# Altium project 60p_numpad.PrjPcb
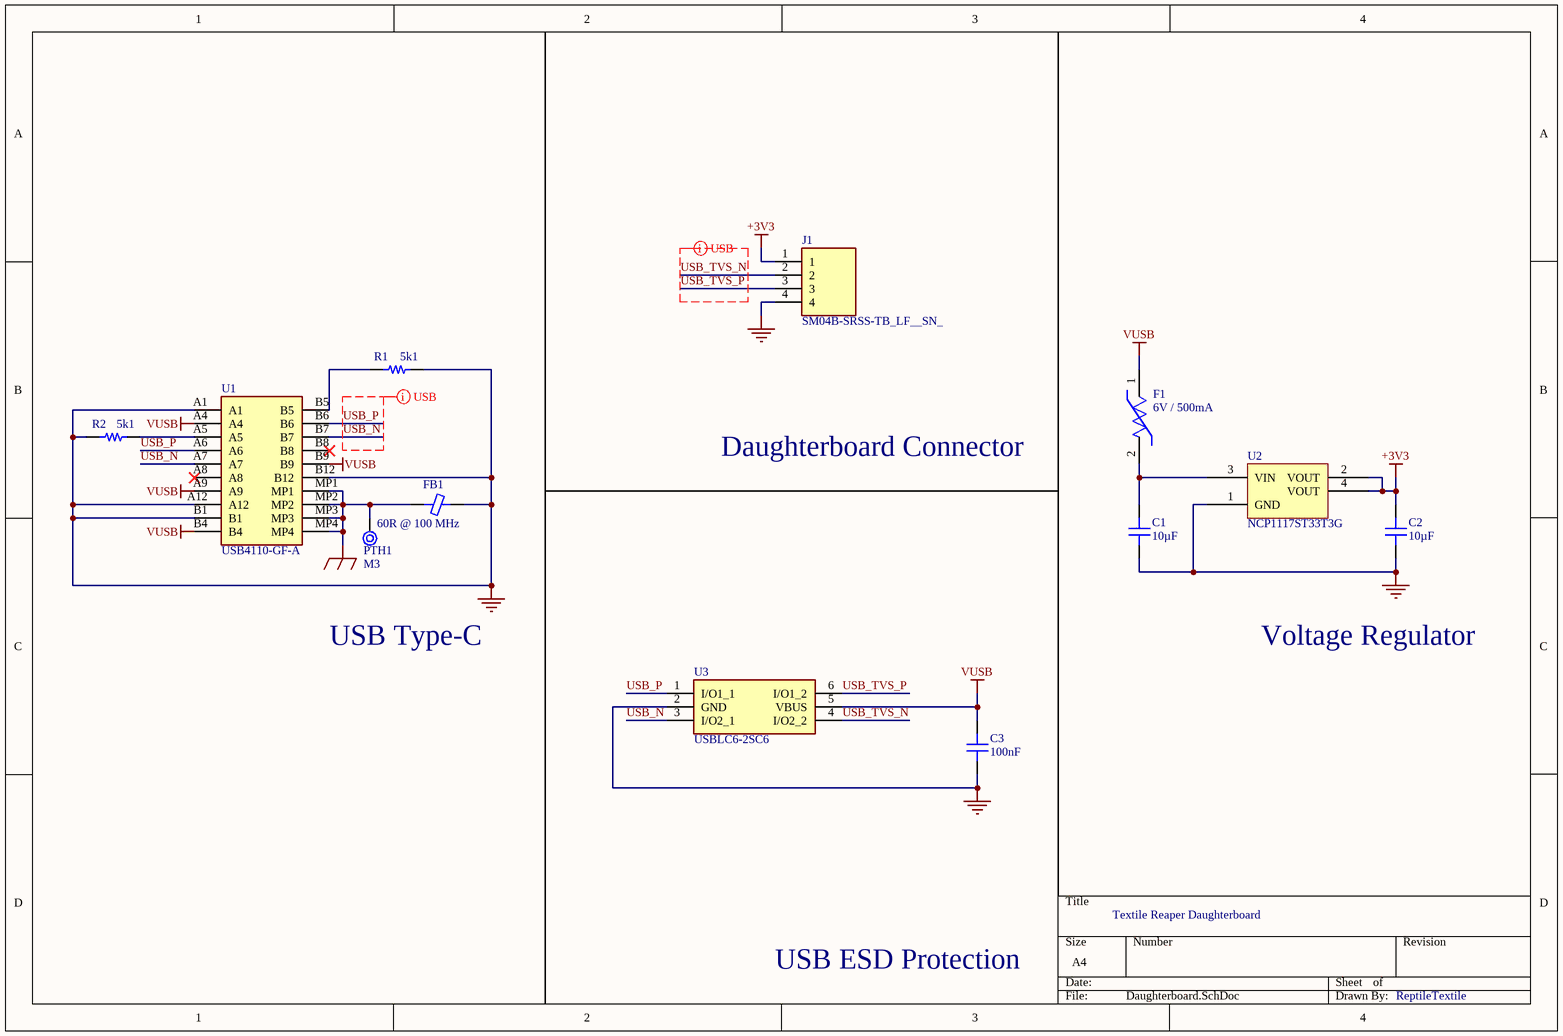
[diagram p0: Daughterboard.SchDoc]
2 sheets, 204 parts. Net scope: global (net labels, ports and power ports of the same name join across sheets).
Board files: DaughterboardPCB.PcbDoc, MainboardPCB.PcbDoc
Sheets:
  Daughterboard.SchDoc
  Mainboard.SchDoc

## Sheet Daughterboard.SchDoc
size A4; SheetNumber: 1; SheetTotal: 1

### Parts
(Parts that share a designator on the sheet are numbered #1, #2 ... from top to bottom, then left to right.)
C1#1  10µF  [CAP 0402_1005]
C2#1  10µF  [CAP 0402_1005]
C3#1  100nF  [CAP 0402_1005]
F1  6V / 500mA  [FP-MF-PSMF-MFG]
FB1  60R @ 100 MHz  [FER 0603_1608]
J1#1  SM04B-SRSS-TB_LF__SN_  [SM04B-SRSS-TB(LFSN)]
PTH1  M3  [SCREW_HOLE]
R1  5k1  [RES 0402_1005]
R2#1  5k1  [RES 0402_1005]
U1#1  USB4110-GF-A  [USB4110GFA]
U2#1  NCP1117ST33T3G  [ON SEMI SOT-223 ST(318H)]
U3  USBLC6-2SC6  [SOT95P280X145-6N]

### Nets
+3V3: C2#1.2 J1#1.1 U2#1.2(VOUT) U2#1.4(VOUT)
CHASIS: FB1.1 PTH1.0 U1#1.MP1 U1#1.MP2 U1#1.MP3 U1#1.MP4
GND: C1#1.1 C2#1.1 C3#1.1 FB1.2 J1#1.4 R1.2 R2#1.1 U1#1.A1 U1#1.A12 U1#1.B1 U1#1.B12 U2#1.1(GND) U3.2(GND)
VUSB: C3#1.2 F1.1 U1#1.A4 U1#1.A9 U1#1.B4 U1#1.B9 U3.5(VBUS)
USB_N: U1#1.A7 U1#1.B7 U3.3(I/O2_1)
USB_P: U1#1.A6 U1#1.B6 U3.1(I/O1_1)
USB_TVS_N: J1#1.2 U3.4(I/O2_2)
USB_TVS_P: J1#1.3 U3.6(I/O1_2)
NetC1#1_2: C1#1.2 F1.2 U2#1.3(VIN)
NetR1_1: R1.1 U1#1.B5
NetR2#1_2: R2#1.2 U1#1.A5

Not connected (* = marked no-connect by the designer): U1#1 A8* B8*

### Layout directives
differential pair; differential pair class USB_Lines; net class USB: USB_N, USB_P
differential pair; net class USB_TVS; differential pair class USB_Lines: USB_TVS_N, USB_TVS_P

### Notes on the sheet
- Daughterboard Connector
- USB Type-C
- Voltage Regulator
- Textile Reaper Daughterboard
- USB ESD Protection
- ReptileTextile

### Library data of the parts
C1#1 C2#1 = CL05A106MP8NUB8: CAP CER 10UF 10V X5R 0402; manufacturer: Samsung Electro-Mechanics; Tolerance: ±20%; Part Number: CL05A106MP8NUB8; Value: 10µF; Applications: General Purpose; Capacitance: 10 µF; componentlink1description: Datasheet; componentlink1url: http://www.samsungsem.com/kr/support/product-search/mlcc/CL05A106MP8NUB8.jsp; componentlink2description: DigiKey Link; componentlink2url: https://www.digikey.com/en/products/detail/samsung-electro-mechanics/CL05A106MP8NUB8/5961314; Device Package: 0402 (1005 Metric); lastupdated: 11.08.2022 08:52:23; Lifecycle Status: Active; Minimum Order: 1; Mounting Type: Surface Mount, MLCC; Operating Temperature: -55°C ~ 85°C; Package / Case: 0402 (1005 Metric); packaging: TapeAndReel; partid: 1758; Part Status: Active; price: 0.07; series: CL; Size / Dimension: 0.039" L x 0.020" W (1.00mm x 0.50mm); Supplier 1: DigiKey; Supplier Part Number 1: 1276-6830-1-ND; Temperature Coefficient: X5R; Thickness (Max): 0.035" (0.90mm); Voltage - Rated: 10V
C3#1 = C0402C104K4RECAUTO: CAP CER 0402 0.1UF 16V X7R 10%; manufacturer: KEMET; Capacitance: 0.1 µF; Part Number: C0402C104K4RECAUTO; Value: 100nF; Applications: Automotive, ESD Protection; componentlink1description: Datasheet; componentlink1url: https://api.kemet.com/component-edge/download/datasheet/C0402C104K4RECAUTO.pdf; componentlink2description: DigiKey Link; componentlink2url: https://www.digikey.com/en/products/detail/kemet/C0402C104K4RECAUTO/8563695; Device Package: 0402 (1005 Metric); lastupdated: 11.08.2022 08:52:24; Lifecycle Status: Active; Minimum Order: 1; Mounting Type: Surface Mount, MLCC; Operating Temperature: -55°C ~ 125°C; Package / Case: 0402 (1005 Metric); packaging: TapeAndReel; partid: 1731; Part Status: Active; price: 0.02; Ratings: AEC-Q200; series: ESD SMD Auto X7R; Size / Dimension: 0.039" L x 0.020" W (1.00mm x 0.50mm); Supplier 1: DigiKey; Supplier Part Number 1: 399-17167-1-ND; Temperature Coefficient: X7R; Thickness (Max): 0.022" (0.55mm); Tolerance: ±10%; Voltage - Rated: 16V
F1 = CMP-07400-000013-1: PTC RESET FUSE 6V 500MA 0805; Manufacturer Part Number: MF-PSMF050X-2; Manufacturer: Bourns Inc.; Trip Current: 1A; Trip Time: 0.1s; Value: 0.15-0.9Ω; Hold Current: 0.5A; Current Rating: 40A; Category: Fuse; Temperature: -40°C to +85°C; ComponentLink2Description: Datasheet; Temperature Range High: +85°C; Package: MF-PSMF; Device Class L1: Circuit Protection; Lead Free: Yes; ComponentLink2URL: https://www.bourns.com/docs/product-datasheets/mfpsmf.pdf?sfvrsn=9c05cafe_24; Ambient Temperature Range Low: -40°C; Mouser Description: Resettable Fuses - PPTC .50A 6V 0.15ohm Hold .5 Trip 1; Resistance: 0.15-0.9Ω; Automotive: Yes; Ambient Temperature Range High: +85°C; Device Class L2: PTC Resettable Fuses; Temperature Range Low: -40°C; Device Class L3: unset; Octopart: https://octopart.com/mf-psmf050x-2-bourns-7483438; Digikey Description: PTC RESET FUSE 6V 500MA 0805; Height: 0.85mm; RoHS: TRUE; Voltage Rating: 6V
FB1 = FBTH1608HE600-T: FERRITE BEAD,HIGH CURRENT, 0603; Manufacturer: Taiyo Yuden; Current Rating (Max): 2.25A; DC Resistance (DCR) (Max): 25mOhm; Filter Type: Power Line; Impedance @ Frequency: 60 Ohms @ 100 MHz; Number of Lines: 1; Part Number: FBTH1608HE600-T; ComponentLink1Description: Datasheet; ComponentLink1URL: https://ds.yuden.co.jp/TYCOMPAS/ut/detail?pn=FBTH1608HE600-T&u=M; ComponentLink2Description: DigiKey Link; ComponentLink2URL: https://www.digikey.com/en/products/detail/taiyo-yuden/FBTH1608HE600-T/10324933; Device Package: 0603 (1608 Metric); Height (Max): 0.037" (0.95mm); LastUpdated: 11.08.2022 09:33:59; Lifecycle Status: Active; Minimum Order: 1; Mounting Type: Surface Mount; Operating Temperature: -40°C ~ 150°C; Package / Case: 0603 (1608 Metric); Packaging: TapeAndReel; PartId: 706; Part Status: Active; Price: 0.09; Ratings: AEC-Q200; Series: FB; Size / Dimension: 0.063" L x 0.031" W (1.60mm x 0.80mm); Supplier 1: DigiKey; Supplier Part Number 1: 587-6594-1-ND; Value: 60R @ 100 MHz
J1#1 = SM04B-SRSS-TB_LF__SN_: Connector; Manufacturer_Name: JST (JAPAN SOLDERLESS TERMINALS); Manufacturer_Part_Number: SM04B-SRSS-TB(LF)(SN); Datasheet Link: http://www.jst-mfg.com/product/pdf/eng/eSH.pdf; Arrow Part Number: SM04B-SRSS-TB(LF)(SN); Arrow Price/Stock: https://www.arrow.com/en/products/sm04b-srss-tb-lf-sn/jst-manufacturing
PTH1 = Hole
R1 R2#1 = RC0402JR-075K1L: RES 5.1K OHM 5% 1/16W 0402; Manufacturer: Yageo; Power (Watts): 0.063W, 1/16W; Resistance: 5.1 kOhms; Temperature Coefficient: ±100ppm/°C; Part Number: RC0402JR-075K1L; Value: 5k1; ComponentLink1Description: Datasheet; ComponentLink1URL: https://www.yageo.com/upload/media/product/productsearch/datasheet/rchip/PYu-RC_Group_51_RoHS_L_10.pdf; ComponentLink2Description: DigiKey Link; ComponentLink2URL: https://www.digikey.com/en/products/detail/yageo/RC0402JR-075K1L/726487; Composition: Thick Film; Device Package: 0402 (1005 Metric); Features: Moisture Resistant; Height - Seated (Max): 0.016" (0.40mm); LastUpdated: 11.08.2022 09:08:05; Lifecycle Status: Active; Minimum Order: 1; Number of Terminations: 2; Operating Temperature: -55°C ~ 155°C; Package / Case: 0402 (1005 Metric); Packaging: CutTape; PartId: 4786; Part Status: Active; Price: 0.01; Series: RC_L; Size / Dimension: 0.039" L x 0.020" W (1.00mm x 0.50mm); Supplier 1: DigiKey; Supplier Part Number 1: 311-5.1KJRCT-ND; Supplier Device Package: 0402; Tolerance: ±5%
U1#1 = USB4110-GF-A: Connector; Manufacturer_Name: GCT (GLOBAL CONNECTOR TECHNOLOGY); Datasheet Link: https://gct.co/files/drawings/usb4110.pdf; Height: 3.26mm; Manufacturer_Part_Number: USB4110-GF-A; Mouser Part Number: 640-USB4110-GF-A; Mouser Price/Stock: https://www.mouser.co.uk/ProductDetail/GCT/USB4110-GF-A?qs=KUoIvG%2F9IlYiZvIXQjyJeA%3D%3D
U2#1 = NCP1117ST33T3G: IC REG LINEAR 3.3V 1A SOT223; Manufacturer: ON Semiconductor; Current - Quiescent (Iq): 10mA; Number of Regulators: 1; Output Configuration: Positive; Output Type: Fixed; Protection Features: Over Current, Over Temperature; PSRR: 64dB (120Hz); Voltage Dropout (Max): 1.2V @ 800mA; Voltage - Input (Max): 20V; Part Number: NCP1117ST33T3G; ComponentLink1Description: Datasheet; ComponentLink1URL: https://www.onsemi.com/pub/Collateral/NCP1117-D.PDF; ComponentLink2Description: DigiKey Link; ComponentLink2URL: http://digikey.com/product-detail/en/on-semiconductor/NCP1117ST33T3G/NCP1117ST33T3GOSCT-ND/660708; Current - Output: 1A; LastUpdated: 9.08.2022 12:47:35; Lifecycle Status: Active; Minimum Order: 1; Mounting Type: Surface Mount; Package / Case: TO-261-4, TO-261AA; Packaging: TapeAndReel; Part Status: Active; Price: 0.15; Series: -; Supplier 1: DigiKey; Supplier Part Number 1: NCP1117ST33T3GOSCT-ND; Supplier Device Package: SOT-223; Voltage - Output (Min/Fixed): 3.3V
U3 = USBLC6-2SC6: Integrated Circuit; Manufacturer_Name: STMicroelectronics; Datasheet Link: http://www.st.com/st-web-ui/static/active/en/resource/technical/document/datasheet/CD00050750.pdf; Height: 1.45mm; Manufacturer_Part_Number: USBLC6-2SC6; Mouser Part Number: 511-USBLC6-2SC6; Mouser Price/Stock: https://www.mouser.co.uk/ProductDetail/STMicroelectronics/USBLC6-2SC6?qs=po45yt2pPpu%2FhNIlwQdTlg%3D%3D; Arrow Part Number: USBLC6-2SC6; Arrow Price/Stock: https://www.arrow.com/en/products/usblc6-2sc6/stmicroelectronics?region=nac

## Sheet Mainboard.SchDoc
size A2; SheetNumber: 1; SheetTotal: 1
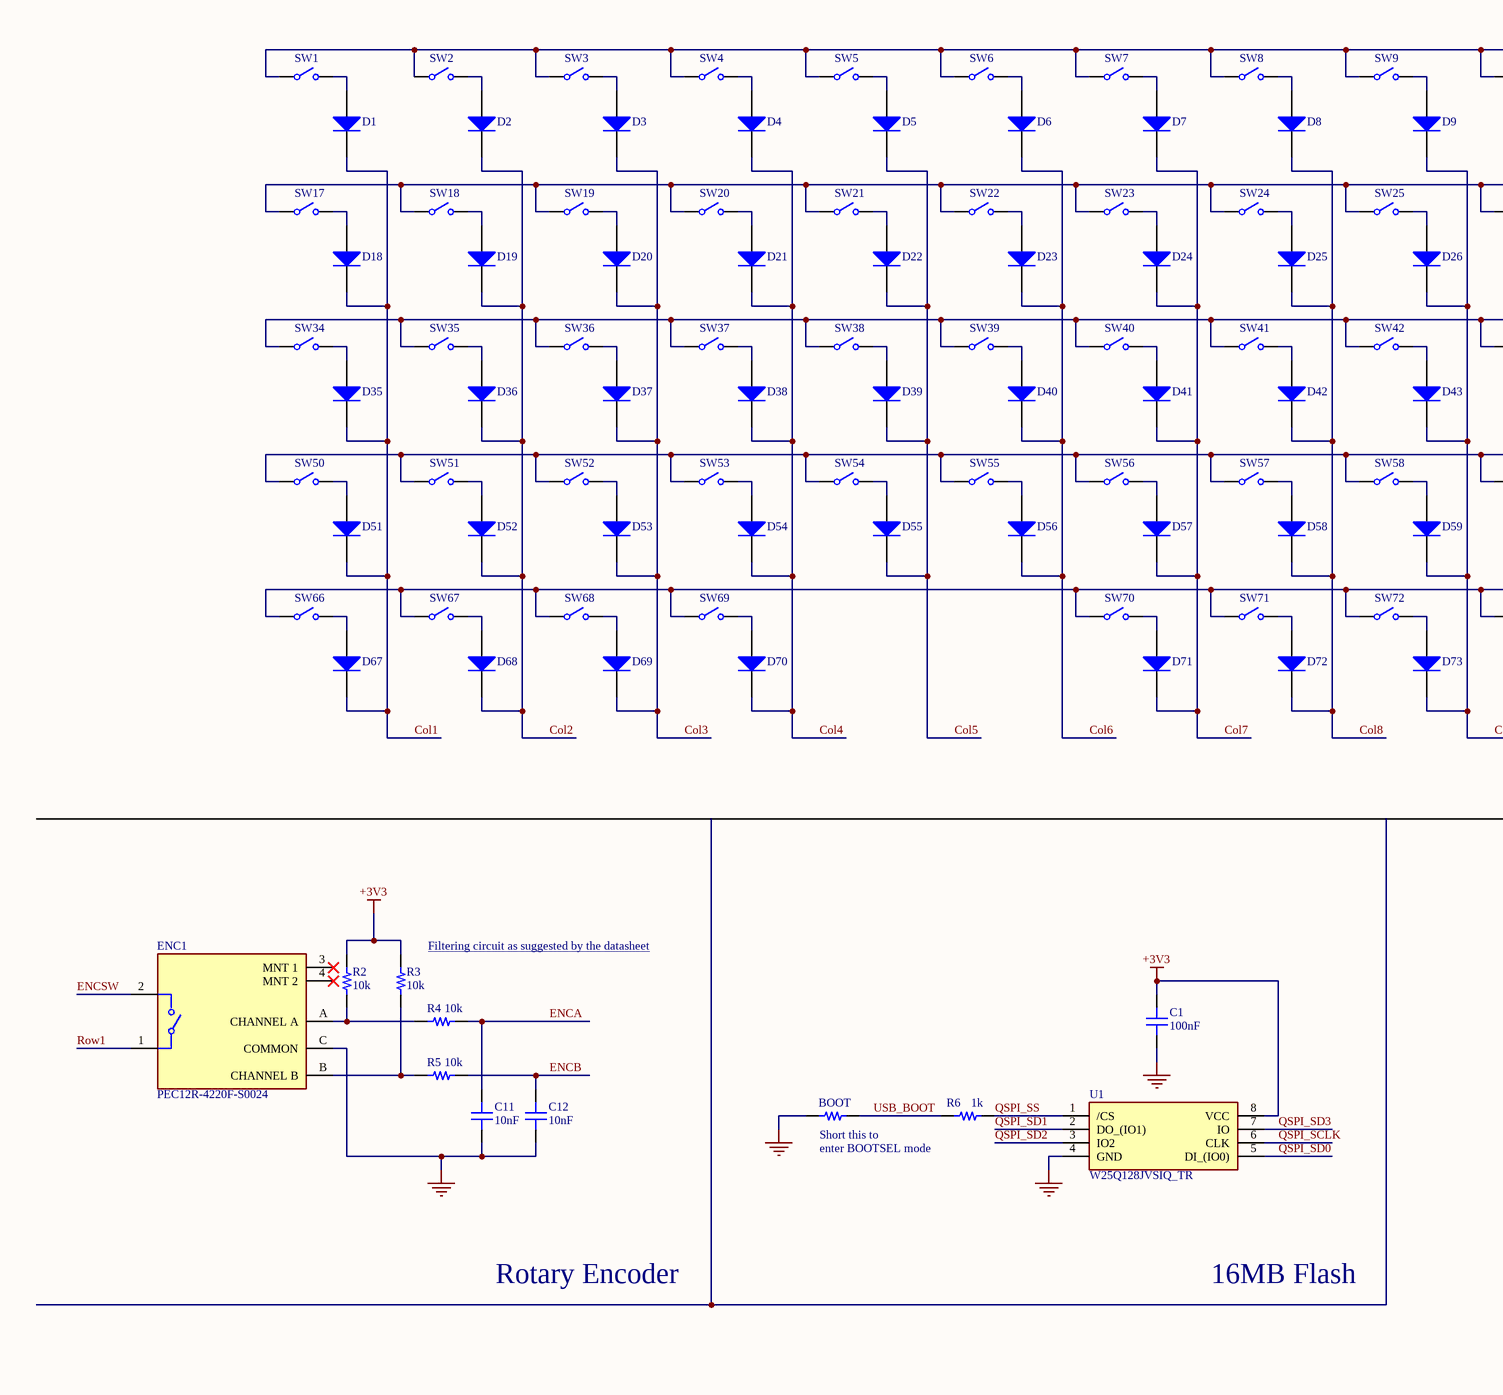
[diagram p1: Mainboard.SchDoc, left]
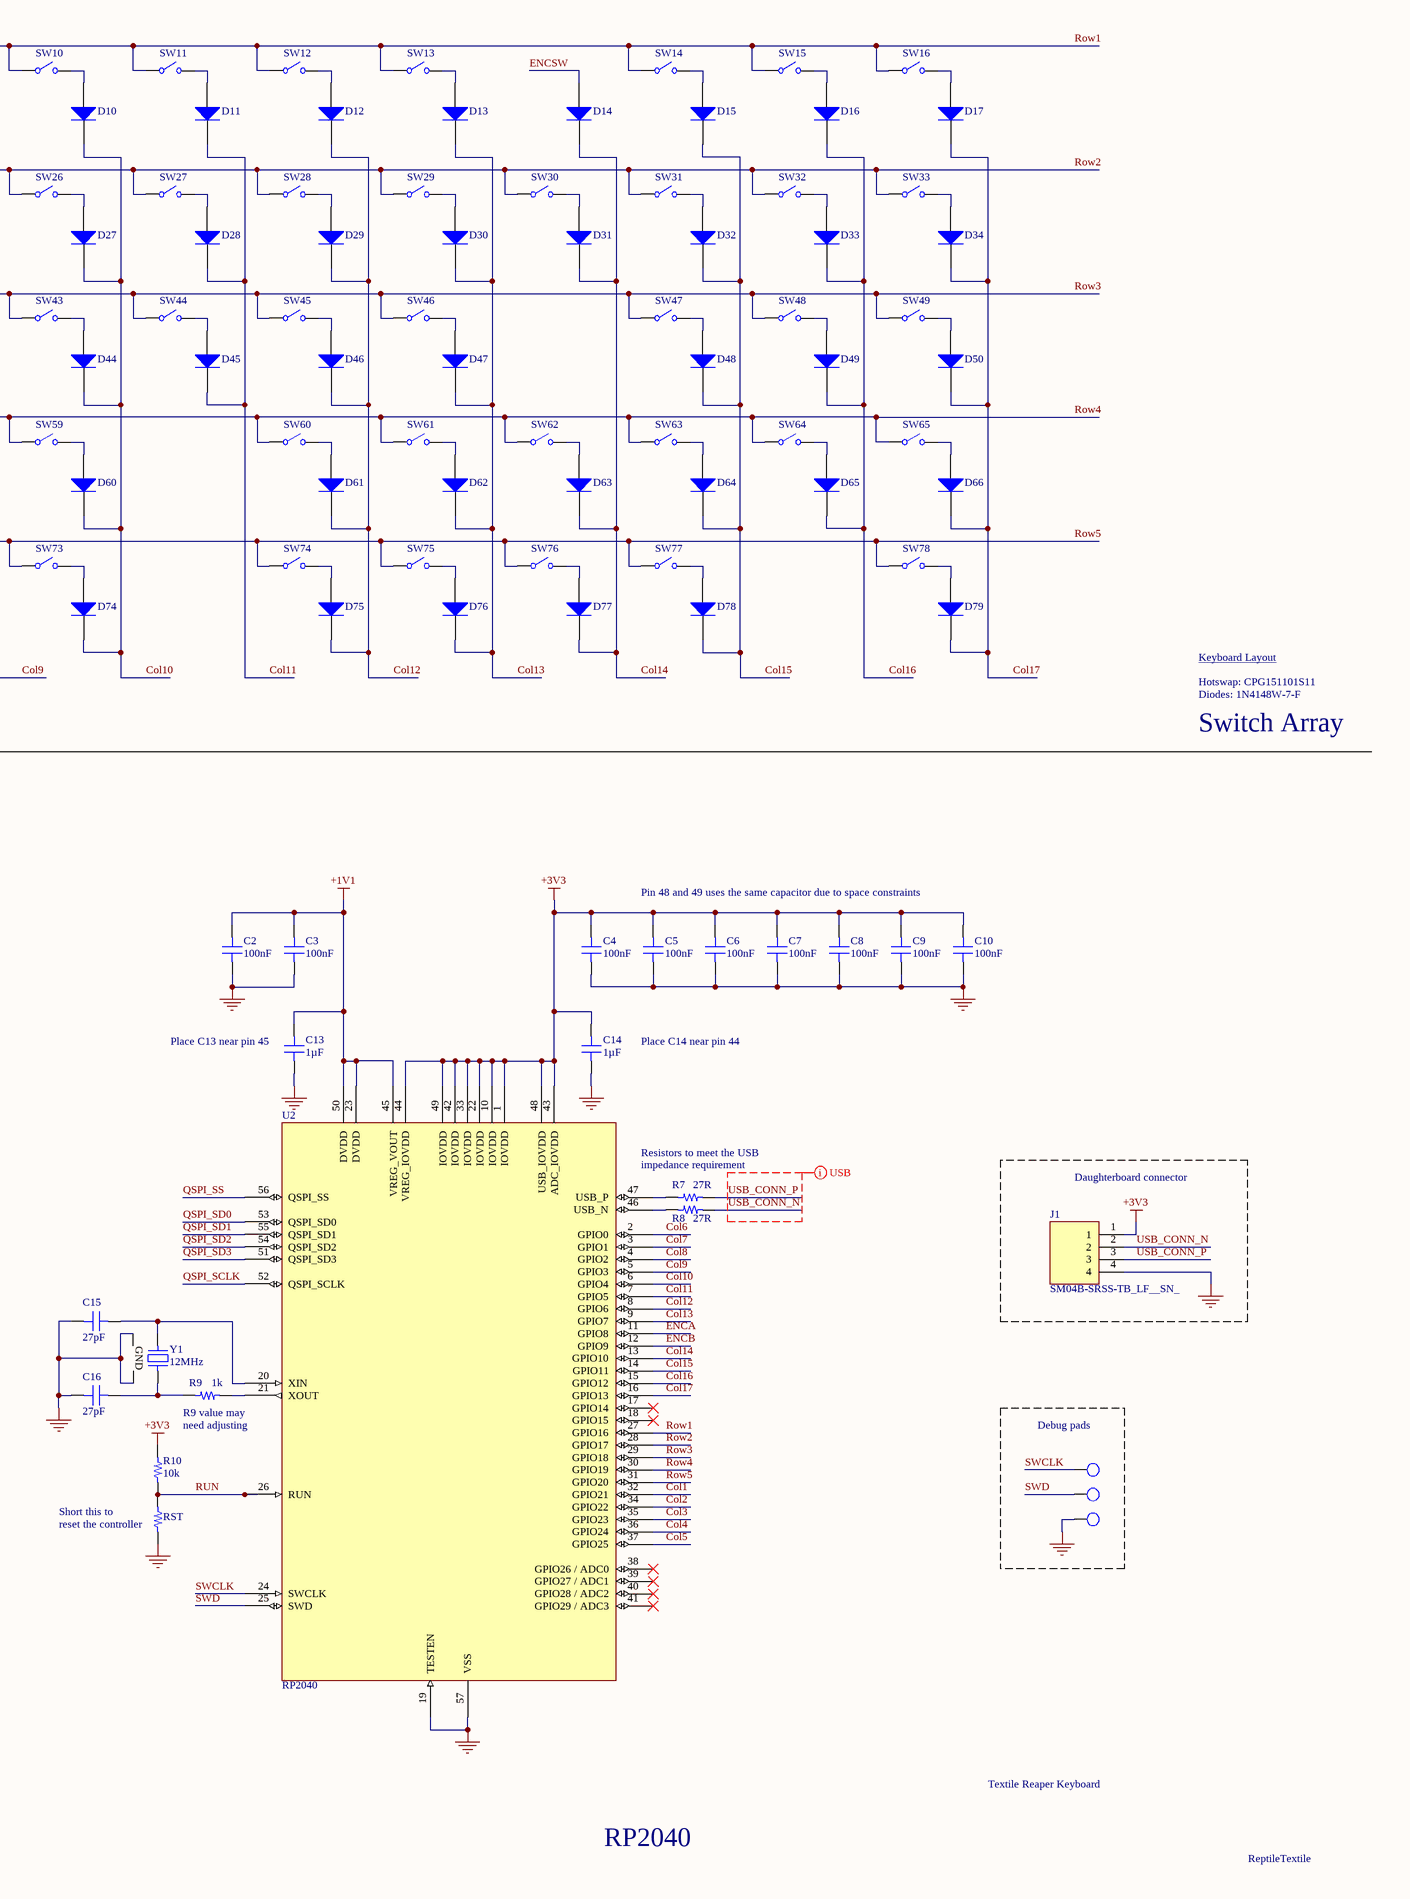
[diagram p2: Mainboard.SchDoc, right]

### Parts
(Parts that share a designator on the sheet are numbered #1, #2 ... from top to bottom, then left to right.)
BOOT  0  [RES 0402_1005]  (value not drawn)
C1#2  100nF  [CAP 0402_1005]
C2#2  100nF  [CAP 0402_1005]
C3#2  100nF  [CAP 0402_1005]
C4  100nF  [CAP 0402_1005]
C5  100nF  [CAP 0402_1005]
C6  100nF  [CAP 0402_1005]
C7  100nF  [CAP 0402_1005]
C8  100nF  [CAP 0402_1005]
C9  100nF  [CAP 0402_1005]
C10  100nF  [CAP 0402_1005]
C11  10nF  [CAP 0402_1005]
C12  10nF  [CAP 0402_1005]
C13  1µF  [CAP 0402_1005]
C14  1µF  [CAP 0402_1005]
C15  27pF  [CAP 0402_1005]
C16  27pF  [CAP 0402_1005]
D1  1N4148W-7-F  [DIOD-SOD123-2_V]  (value not drawn)
D2  1N4148W-7-F  [DIOD-SOD123-2_V]  (value not drawn)
D3  1N4148W-7-F  [DIOD-SOD123-2_V]  (value not drawn)
D4  1N4148W-7-F  [DIOD-SOD123-2_V]  (value not drawn)
D5  1N4148W-7-F  [DIOD-SOD123-2_V]  (value not drawn)
D6  1N4148W-7-F  [DIOD-SOD123-2_V]  (value not drawn)
D7  1N4148W-7-F  [DIOD-SOD123-2_V]  (value not drawn)
D8  1N4148W-7-F  [DIOD-SOD123-2_V]  (value not drawn)
D9  1N4148W-7-F  [DIOD-SOD123-2_V]  (value not drawn)
D10  1N4148W-7-F  [DIOD-SOD123-2_V]  (value not drawn)
D11  1N4148W-7-F  [DIOD-SOD123-2_V]  (value not drawn)
D12  1N4148W-7-F  [DIOD-SOD123-2_V]  (value not drawn)
D13  1N4148W-7-F  [DIOD-SOD123-2_V]  (value not drawn)
D14  1N4148W-7-F  [DIOD-SOD123-2_V]  (value not drawn)
D15  1N4148W-7-F  [DIOD-SOD123-2_V]  (value not drawn)
D16  1N4148W-7-F  [DIOD-SOD123-2_V]  (value not drawn)
D17  1N4148W-7-F  [DIOD-SOD123-2_V]  (value not drawn)
D18  1N4148W-7-F  [DIOD-SOD123-2_V]  (value not drawn)
D19  1N4148W-7-F  [DIOD-SOD123-2_V]  (value not drawn)
D20  1N4148W-7-F  [DIOD-SOD123-2_V]  (value not drawn)
D21  1N4148W-7-F  [DIOD-SOD123-2_V]  (value not drawn)
D22  1N4148W-7-F  [DIOD-SOD123-2_V]  (value not drawn)
D23  1N4148W-7-F  [DIOD-SOD123-2_V]  (value not drawn)
D24  1N4148W-7-F  [DIOD-SOD123-2_V]  (value not drawn)
D25  1N4148W-7-F  [DIOD-SOD123-2_V]  (value not drawn)
D26  1N4148W-7-F  [DIOD-SOD123-2_V]  (value not drawn)
D27  1N4148W-7-F  [DIOD-SOD123-2_V]  (value not drawn)
D28  1N4148W-7-F  [DIOD-SOD123-2_V]  (value not drawn)
D29  1N4148W-7-F  [DIOD-SOD123-2_V]  (value not drawn)
D30  1N4148W-7-F  [DIOD-SOD123-2_V]  (value not drawn)
D31  1N4148W-7-F  [DIOD-SOD123-2_V]  (value not drawn)
D32  1N4148W-7-F  [DIOD-SOD123-2_V]  (value not drawn)
D33  1N4148W-7-F  [DIOD-SOD123-2_V]  (value not drawn)
D34  1N4148W-7-F  [DIOD-SOD123-2_V]  (value not drawn)
D35  1N4148W-7-F  [DIOD-SOD123-2_V]  (value not drawn)
D36  1N4148W-7-F  [DIOD-SOD123-2_V]  (value not drawn)
D37  1N4148W-7-F  [DIOD-SOD123-2_V]  (value not drawn)
D38  1N4148W-7-F  [DIOD-SOD123-2_V]  (value not drawn)
D39  1N4148W-7-F  [DIOD-SOD123-2_V]  (value not drawn)
D40  1N4148W-7-F  [DIOD-SOD123-2_V]  (value not drawn)
D41  1N4148W-7-F  [DIOD-SOD123-2_V]  (value not drawn)
D42  1N4148W-7-F  [DIOD-SOD123-2_V]  (value not drawn)
D43  1N4148W-7-F  [DIOD-SOD123-2_V]  (value not drawn)
D44  1N4148W-7-F  [DIOD-SOD123-2_V]  (value not drawn)
D45  1N4148W-7-F  [DIOD-SOD123-2_V]  (value not drawn)
D46  1N4148W-7-F  [DIOD-SOD123-2_V]  (value not drawn)
D47  1N4148W-7-F  [DIOD-SOD123-2_V]  (value not drawn)
D48  1N4148W-7-F  [DIOD-SOD123-2_V]  (value not drawn)
D49  1N4148W-7-F  [DIOD-SOD123-2_V]  (value not drawn)
D50  1N4148W-7-F  [DIOD-SOD123-2_V]  (value not drawn)
D51  1N4148W-7-F  [DIOD-SOD123-2_V]  (value not drawn)
D52  1N4148W-7-F  [DIOD-SOD123-2_V]  (value not drawn)
D53  1N4148W-7-F  [DIOD-SOD123-2_V]  (value not drawn)
D54  1N4148W-7-F  [DIOD-SOD123-2_V]  (value not drawn)
D55  1N4148W-7-F  [DIOD-SOD123-2_V]  (value not drawn)
D56  1N4148W-7-F  [DIOD-SOD123-2_V]  (value not drawn)
D57  1N4148W-7-F  [DIOD-SOD123-2_V]  (value not drawn)
D58  1N4148W-7-F  [DIOD-SOD123-2_V]  (value not drawn)
D59  1N4148W-7-F  [DIOD-SOD123-2_V]  (value not drawn)
D60  1N4148W-7-F  [DIOD-SOD123-2_V]  (value not drawn)
D61  1N4148W-7-F  [DIOD-SOD123-2_V]  (value not drawn)
D62  1N4148W-7-F  [DIOD-SOD123-2_V]  (value not drawn)
D63  1N4148W-7-F  [DIOD-SOD123-2_V]  (value not drawn)
D64  1N4148W-7-F  [DIOD-SOD123-2_V]  (value not drawn)
D65  1N4148W-7-F  [DIOD-SOD123-2_V]  (value not drawn)
D66  1N4148W-7-F  [DIOD-SOD123-2_V]  (value not drawn)
D67  1N4148W-7-F  [DIOD-SOD123-2_V]  (value not drawn)
D68  1N4148W-7-F  [DIOD-SOD123-2_V]  (value not drawn)
D69  1N4148W-7-F  [DIOD-SOD123-2_V]  (value not drawn)
D70  1N4148W-7-F  [DIOD-SOD123-2_V]  (value not drawn)
D71  1N4148W-7-F  [DIOD-SOD123-2_V]  (value not drawn)
D72  1N4148W-7-F  [DIOD-SOD123-2_V]  (value not drawn)
D73  1N4148W-7-F  [DIOD-SOD123-2_V]  (value not drawn)
D74  1N4148W-7-F  [DIOD-SOD123-2_V]  (value not drawn)
D75  1N4148W-7-F  [DIOD-SOD123-2_V]  (value not drawn)
D76  1N4148W-7-F  [DIOD-SOD123-2_V]  (value not drawn)
D77  1N4148W-7-F  [DIOD-SOD123-2_V]  (value not drawn)
D78  1N4148W-7-F  [DIOD-SOD123-2_V]  (value not drawn)
D79  1N4148W-7-F  [DIOD-SOD123-2_V]  (value not drawn)
ENC1  PEC12R-4220F-S0024  [FP-PEC12R-4220F-S0024-MFG]
GND  Pad  [Square_Pad]  (value not drawn)
J1#2  SM04B-SRSS-TB_LF__SN_  [SM04B-SRSS-TB(LFSN)]
R2#2  10k  [RES 0402_1005]
R3  10k  [RES 0402_1005]
R4  10k  [RES 0402_1005]
R5  10k  [RES 0402_1005]
R6  1k  [RES 0402_1005]
R7  27R  [RES 0402_1005]
R8  27R  [RES 0402_1005]
R9  1k  [RES 0402_1005]
R10  10k  [RES 0402_1005]
RST  0  [RES 0402_1005]  (value not drawn)
SW1  CPG151101S11  [CPG151101S11]  (value not drawn)
SW2  CPG151101S11  [CPG151101S11]  (value not drawn)
SW3  CPG151101S11  [CPG151101S11]  (value not drawn)
SW4  CPG151101S11  [CPG151101S11]  (value not drawn)
SW5  CPG151101S11  [CPG151101S11]  (value not drawn)
SW6  CPG151101S11  [CPG151101S11]  (value not drawn)
SW7  CPG151101S11  [CPG151101S11]  (value not drawn)
SW8  CPG151101S11  [CPG151101S11]  (value not drawn)
SW9  CPG151101S11  [CPG151101S11]  (value not drawn)
SW10  CPG151101S11  [CPG151101S11]  (value not drawn)
SW11  CPG151101S11  [CPG151101S11]  (value not drawn)
SW12  CPG151101S11  [CPG151101S11]  (value not drawn)
SW13  CPG151101S11  [CPG151101S11]  (value not drawn)
SW14  CPG151101S11  [CPG151101S11]  (value not drawn)
SW15  CPG151101S11  [CPG151101S11]  (value not drawn)
SW16  CPG151101S11  [CPG151101S11]  (value not drawn)
SW17  CPG151101S11  [CPG151101S11]  (value not drawn)
SW18  CPG151101S11  [CPG151101S11]  (value not drawn)
SW19  CPG151101S11  [CPG151101S11]  (value not drawn)
SW20  CPG151101S11  [CPG151101S11]  (value not drawn)
SW21  CPG151101S11  [CPG151101S11]  (value not drawn)
SW22  CPG151101S11  [CPG151101S11]  (value not drawn)
SW23  CPG151101S11  [CPG151101S11]  (value not drawn)
SW24  CPG151101S11  [CPG151101S11]  (value not drawn)
SW25  CPG151101S11  [CPG151101S11]  (value not drawn)
SW26  CPG151101S11  [CPG151101S11]  (value not drawn)
SW27  CPG151101S11  [CPG151101S11]  (value not drawn)
SW28  CPG151101S11  [CPG151101S11]  (value not drawn)
SW29  CPG151101S11  [CPG151101S11]  (value not drawn)
SW30  CPG151101S11  [CPG151101S11]  (value not drawn)
SW31  CPG151101S11  [CPG151101S11]  (value not drawn)
SW32  CPG151101S11  [CPG151101S11]  (value not drawn)
SW33  CPG151101S11  [CPG151101S11]  (value not drawn)
SW34  CPG151101S11  [CPG151101S11]  (value not drawn)
SW35  CPG151101S11  [CPG151101S11]  (value not drawn)
SW36  CPG151101S11  [CPG151101S11]  (value not drawn)
SW37  CPG151101S11  [CPG151101S11]  (value not drawn)
SW38  CPG151101S11  [CPG151101S11]  (value not drawn)
SW39  CPG151101S11  [CPG151101S11]  (value not drawn)
SW40  CPG151101S11  [CPG151101S11]  (value not drawn)
SW41  CPG151101S11  [CPG151101S11]  (value not drawn)
SW42  CPG151101S11  [CPG151101S11]  (value not drawn)
SW43  CPG151101S11  [CPG151101S11]  (value not drawn)
SW44  CPG151101S11  [CPG151101S11]  (value not drawn)
SW45  CPG151101S11  [CPG151101S11]  (value not drawn)
SW46  CPG151101S11  [CPG151101S11]  (value not drawn)
SW47  CPG151101S11  [CPG151101S11]  (value not drawn)
SW48  CPG151101S11  [CPG151101S11]  (value not drawn)
SW49  CPG151101S11  [CPG151101S11]  (value not drawn)
SW50  CPG151101S11  [CPG151101S11]  (value not drawn)
SW51  CPG151101S11  [CPG151101S11]  (value not drawn)
SW52  CPG151101S11  [CPG151101S11]  (value not drawn)
SW53  CPG151101S11  [CPG151101S11]  (value not drawn)
SW54  CPG151101S11  [CPG151101S11]  (value not drawn)
SW55  CPG151101S11  [CPG151101S11]  (value not drawn)
SW56  CPG151101S11  [CPG151101S11]  (value not drawn)
SW57  CPG151101S11  [CPG151101S11]  (value not drawn)
SW58  CPG151101S11  [CPG151101S11]  (value not drawn)
SW59  CPG151101S11  [CPG151101S11]  (value not drawn)
SW60  CPG151101S11  [CPG151101S11]  (value not drawn)
SW61  CPG151101S11  [CPG151101S11]  (value not drawn)
SW62  CPG151101S11  [CPG151101S11]  (value not drawn)
SW63  CPG151101S11  [CPG151101S11]  (value not drawn)
SW64  CPG151101S11  [CPG151101S11]  (value not drawn)
SW65  CPG151101S11  [CPG151101S11]  (value not drawn)
SW66  CPG151101S11  [CPG151101S11]  (value not drawn)
SW67  CPG151101S11  [CPG151101S11]  (value not drawn)
SW68  CPG151101S11  [CPG151101S11]  (value not drawn)
SW69  CPG151101S11  [CPG151101S11]  (value not drawn)
SW70  CPG151101S11  [CPG151101S11]  (value not drawn)
SW71  CPG151101S11  [CPG151101S11]  (value not drawn)
SW72  CPG151101S11  [CPG151101S11]  (value not drawn)
SW73  CPG151101S11  [CPG151101S11]  (value not drawn)
SW74  CPG151101S11  [CPG151101S11]  (value not drawn)
SW75  CPG151101S11  [CPG151101S11]  (value not drawn)
SW76  CPG151101S11  [CPG151101S11]  (value not drawn)
SW77  CPG151101S11  [CPG151101S11]  (value not drawn)
SW78  CPG151101S11  [CPG151101S11]  (value not drawn)
SWCLK  Pad  [Square_Pad]  (value not drawn)
SWD  Pad  [Square_Pad]  (value not drawn)
U1#2  W25Q128JVSIQ_TR  [SOIC127P780X195-8N]
U2#2  RP2040  [RP2040_QFN56]
Y1  12MHz  [ABRACON ABM8G]

### Blocks framed on the sheet
Daughterboard connector: J1#2
Debug pads: GND SWCLK SWD

### Nets
+1V1: C2#2.2 C3#2.2 C13.2 U2#2.23(DVDD) U2#2.45(VREG_VOUT) U2#2.50(DVDD)
+3V3: C1#2.2 C4.2 C5.2 C6.2 C7.2 C8.2 C9.2 C10.2 C14.2 J1#2.1 R2#2.1 R3.1 R10.1 U1#2.8(VCC) U2#2.1(IOVDD) U2#2.10(IOVDD) U2#2.22(IOVDD) U2#2.33(IOVDD) U2#2.42(IOVDD) U2#2.43(ADC_IOVDD) U2#2.44(VREG_IOVDD) U2#2.48(USB_IOVDD) U2#2.49(IOVDD)
GND: BOOT.1 C1#2.1 C2#2.1 C3#2.1 C4.1 C5.1 C6.1 C7.1 C8.1 C9.1 C10.1 C11.1 C12.1 C13.1 C14.1 C15.1 C16.1 ENC1.C(COMMON) GND.0 J1#2.4 RST.1 U1#2.4(GND) U2#2.19(TESTEN) U2#2.57(VSS) Y1.2(GND) Y1.4(GND)
Col1: D1.2(K) D18.2(K) D35.2(K) D51.2(K) D67.2(K) U2#2.32(GPIO21)
Col2: D2.2(K) D19.2(K) D36.2(K) D52.2(K) D68.2(K) U2#2.34(GPIO22)
Col3: D3.2(K) D20.2(K) D37.2(K) D53.2(K) D69.2(K) U2#2.35(GPIO23)
Col4: D4.2(K) D21.2(K) D38.2(K) D54.2(K) D70.2(K) U2#2.36(GPIO24)
Col5: D5.2(K) D22.2(K) D39.2(K) D55.2(K) U2#2.37(GPIO25)
Col6: D6.2(K) D23.2(K) D40.2(K) D56.2(K) U2#2.2(GPIO0)
Col7: D7.2(K) D24.2(K) D41.2(K) D57.2(K) D71.2(K) U2#2.3(GPIO1)
Col8: D8.2(K) D25.2(K) D42.2(K) D58.2(K) D72.2(K) U2#2.4(GPIO2)
Col9: D9.2(K) D26.2(K) D43.2(K) D59.2(K) D73.2(K) U2#2.5(GPIO3)
Col10: D10.2(K) D27.2(K) D44.2(K) D60.2(K) D74.2(K) U2#2.6(GPIO4)
Col11: D11.2(K) D28.2(K) D45.2(K) U2#2.7(GPIO5)
Col12: D12.2(K) D29.2(K) D46.2(K) D61.2(K) D75.2(K) U2#2.8(GPIO6)
Col13: D13.2(K) D30.2(K) D47.2(K) D62.2(K) D76.2(K) U2#2.9(GPIO7)
Col14: D14.2(K) D31.2(K) D63.2(K) D77.2(K) U2#2.13(GPIO10)
Col15: D15.2(K) D32.2(K) D48.2(K) D64.2(K) D78.2(K) U2#2.14(GPIO11)
Col16: D16.2(K) D33.2(K) D49.2(K) D65.2(K) U2#2.15(GPIO12)
Col17: D17.2(K) D34.2(K) D50.2(K) D66.2(K) D79.2(K) U2#2.16(GPIO13)
ENCA: C11.2 R4.2 U2#2.11(GPIO8)
ENCB: C12.2 R5.2 U2#2.12(GPIO9)
ENCSW: D14.1(A) ENC1.2
QSPI_SCLK: U1#2.6(CLK) U2#2.52(QSPI_SCLK)
QSPI_SD0: U1#2.5(DI_(IO0)) U2#2.53(QSPI_SD0)
QSPI_SD1: U1#2.2(DO_(IO1)) U2#2.55(QSPI_SD1)
QSPI_SD2: U1#2.3(IO2) U2#2.54(QSPI_SD2)
QSPI_SD3: U1#2.7(IO) U2#2.51(QSPI_SD3)
QSPI_SS: R6.2 U1#2.1(/CS) U2#2.56(QSPI_SS)
Row1: ENC1.1 SW1.1 SW2.1 SW3.1 SW4.1 SW5.1 SW6.1 SW7.1 SW8.1 SW9.1 SW10.1 SW11.1 SW12.1 SW13.1 SW14.1 SW15.1 SW16.1 U2#2.27(GPIO16)
Row2: SW17.1 SW18.1 SW19.1 SW20.1 SW21.1 SW22.1 SW23.1 SW24.1 SW25.1 SW26.1 SW27.1 SW28.1 SW29.1 SW30.1 SW31.1 SW32.1 SW33.1 U2#2.28(GPIO17)
Row3: SW34.1 SW35.1 SW36.1 SW37.1 SW38.1 SW39.1 SW40.1 SW41.1 SW42.1 SW43.1 SW44.1 SW45.1 SW46.1 SW47.1 SW48.1 SW49.1 U2#2.29(GPIO18)
Row4: SW50.1 SW51.1 SW52.1 SW53.1 SW54.1 SW55.1 SW56.1 SW57.1 SW58.1 SW59.1 SW60.1 SW61.1 SW62.1 SW63.1 SW64.1 SW65.1 U2#2.30(GPIO19)
Row5: SW66.1 SW67.1 SW68.1 SW69.1 SW70.1 SW71.1 SW72.1 SW73.1 SW74.1 SW75.1 SW76.1 SW77.1 SW78.1 U2#2.31(GPIO20)
RUN: R10.2 RST.2 U2#2.26(RUN)
SWCLK: SWCLK.0 U2#2.24(SWCLK)
SWD: SWD.0 U2#2.25(SWD)
USB_BOOT: BOOT.2 R6.1
USB_CONN_N: J1#2.2 R8.2
USB_CONN_P: J1#2.3 R7.2
NetC15_2: C15.2 U2#2.20(XIN) Y1.1
NetC16_2: C16.2 R9.1 Y1.3
NetD1_1: D1.1(A) SW1.2
NetD2_1: D2.1(A) SW2.2
NetD3_1: D3.1(A) SW3.2
NetD4_1: D4.1(A) SW4.2
NetD5_1: D5.1(A) SW5.2
NetD6_1: D6.1(A) SW6.2
NetD7_1: D7.1(A) SW7.2
NetD8_1: D8.1(A) SW8.2
NetD9_1: D9.1(A) SW9.2
NetD10_1: D10.1(A) SW10.2
NetD11_1: D11.1(A) SW11.2
NetD12_1: D12.1(A) SW12.2
NetD13_1: D13.1(A) SW13.2
NetD15_1: D15.1(A) SW14.2
NetD16_1: D16.1(A) SW15.2
NetD17_1: D17.1(A) SW16.2
NetD18_1: D18.1(A) SW17.2
NetD19_1: D19.1(A) SW18.2
NetD20_1: D20.1(A) SW19.2
NetD21_1: D21.1(A) SW20.2
NetD22_1: D22.1(A) SW21.2
NetD23_1: D23.1(A) SW22.2
NetD24_1: D24.1(A) SW23.2
NetD25_1: D25.1(A) SW24.2
NetD26_1: D26.1(A) SW25.2
NetD27_1: D27.1(A) SW26.2
NetD28_1: D28.1(A) SW27.2
NetD29_1: D29.1(A) SW28.2
NetD30_1: D30.1(A) SW29.2
NetD31_1: D31.1(A) SW30.2
NetD32_1: D32.1(A) SW31.2
NetD33_1: D33.1(A) SW32.2
NetD34_1: D34.1(A) SW33.2
NetD35_1: D35.1(A) SW34.2
NetD36_1: D36.1(A) SW35.2
NetD37_1: D37.1(A) SW36.2
NetD38_1: D38.1(A) SW37.2
NetD39_1: D39.1(A) SW38.2
NetD40_1: D40.1(A) SW39.2
NetD41_1: D41.1(A) SW40.2
NetD42_1: D42.1(A) SW41.2
NetD43_1: D43.1(A) SW42.2
NetD44_1: D44.1(A) SW43.2
NetD45_1: D45.1(A) SW44.2
NetD46_1: D46.1(A) SW45.2
NetD47_1: D47.1(A) SW46.2
NetD48_1: D48.1(A) SW47.2
NetD49_1: D49.1(A) SW48.2
NetD50_1: D50.1(A) SW49.2
NetD51_1: D51.1(A) SW50.2
NetD52_1: D52.1(A) SW51.2
NetD53_1: D53.1(A) SW52.2
NetD54_1: D54.1(A) SW53.2
NetD55_1: D55.1(A) SW54.2
NetD56_1: D56.1(A) SW55.2
NetD57_1: D57.1(A) SW56.2
NetD58_1: D58.1(A) SW57.2
NetD59_1: D59.1(A) SW58.2
NetD60_1: D60.1(A) SW59.2
NetD61_1: D61.1(A) SW60.2
NetD62_1: D62.1(A) SW61.2
NetD63_1: D63.1(A) SW62.2
NetD64_1: D64.1(A) SW63.2
NetD65_1: D65.1(A) SW64.2
NetD66_1: D66.1(A) SW65.2
NetD67_1: D67.1(A) SW66.2
NetD68_1: D68.1(A) SW67.2
NetD69_1: D69.1(A) SW68.2
NetD70_1: D70.1(A) SW69.2
NetD71_1: D71.1(A) SW70.2
NetD72_1: D72.1(A) SW71.2
NetD73_1: D73.1(A) SW72.2
NetD74_1: D74.1(A) SW73.2
NetD75_1: D75.1(A) SW74.2
NetD76_1: D76.1(A) SW75.2
NetD77_1: D77.1(A) SW76.2
NetD78_1: D78.1(A) SW77.2
NetD79_1: D79.1(A) SW78.2
NetENC1_A: ENC1.A(CHANNEL_A) R2#2.2 R4.1
NetENC1_B: ENC1.B(CHANNEL_B) R3.2 R5.1
NetR7_1: R7.1 U2#2.47(USB_P)
NetR8_1: R8.1 U2#2.46(USB_N)
NetR9_2: R9.2 U2#2.21(XOUT)

Not connected (* = marked no-connect by the designer): ENC1 3(MNT_1)* 4(MNT_2)*; U2#2 17(GPIO14)* 18(GPIO15)* 38(GPIO26_/_ADC0)* 39(GPIO27_/_ADC1)* 40(GPIO28_/_ADC2)* 41(GPIO29_/_ADC3)*

### Layout directives
differential pair; net class USB_CON; differential pair class USB_Lines: USB_CONN_N, USB_CONN_P

### Notes on the sheet
- Keyboard Layout <http://www.keyboard-layout-editor.com/#/gists/18e42f8a1bafe79e1608f8c00b75eb3d>
- Hotswap: CPG151101S11
- Switch Array
- Diodes: 1N4148W-7-F
- (near R3) Filtering circuit as suggested by the datasheet <https://www.bourns.com/docs/Product-Datasheets/PEC12R.pdf>
- Pin 48 and 49 uses the same capacitor due to space constraints
- enter BOOTSEL mode
- (near BOOT) Short this to
- (near C13) Place C13 near pin 45
- Place C14 near pin 44
- Rotary Encoder
- 16MB Flash
- Resistors to meet the USB
- impedance requirement
- need adjusting
- (near R9) R9 value may
- (near RST) reset the controller
- Short this to
- Textile Reaper Keyboard
- RP2040
- ReptileTextile

### Library data of the parts
BOOT RST = CR0402AJ/-000GAS: RESA-AS 0402 0R JUMPER 63MW; Manufacturer: Bourns Inc.; Power (Watts): 0.063W, 1/16W; Resistance: 0 Ohms; Part Number: CR0402AJ/-000GAS; Value: 0; ComponentLink1Description: Datasheet; ComponentLink1URL: //media.digikey.com/pdf/Data%20Sheets/Bourns%20PDFs/CRyyyyA-AS_Model_DS.pdf; ComponentLink2Description: DigiKey Link; ComponentLink2URL: https://www.digikey.com/en/products/detail/bourns-inc/CR0402AJ-000GAS/10240110; Composition: Thick Film; Device Package: 0402 (1005 Metric); Features: Anti-Sulfur, Automotive AEC-Q200, Moisture Resistant; Height - Seated (Max): 0.015" (0.37mm); LastUpdated: 11.08.2022 09:07:57; Lifecycle Status: Active; Minimum Order: 1; Number of Terminations: 2; Operating Temperature: -55°C ~ 155°C; Package / Case: 0402 (1005 Metric); Packaging: CutTape; PartId: 7106; Part Status: Active; Price: 0.01; Ratings: AEC-Q200; Series: CR0402A-AS; Size / Dimension: 0.039" L x 0.020" W (1.00mm x 0.50mm); Supplier 1: DigiKey; Supplier Part Number 1: CR0402AJ/-000GASCT-ND; Supplier Device Package: 0402; Tolerance: Jumper
C1#2 C2#2 C3#2 C4-C10 = C0402C104K4RECAUTO: as C3#1 on sheet Daughterboard; Part Number: C0402C104K4RECAUTO; Value: 100nF; Applications: Automotive, ESD Protection; componentlink1description: Datasheet; componentlink1url: https://api.kemet.com/component-edge/download/datasheet/C0402C104K4RECAUTO.pdf; componentlink2description: DigiKey Link; componentlink2url: https://www.digikey.com/en/products/detail/kemet/C0402C104K4RECAUTO/8563695; Device Package: 0402 (1005 Metric); lastupdated: 11.08.2022 08:52:24; Lifecycle Status: Active; Minimum Order: 1; Mounting Type: Surface Mount, MLCC; Operating Temperature: -55°C ~ 125°C; Package / Case: 0402 (1005 Metric); packaging: TapeAndReel; partid: 1731; Part Status: Active; price: 0.02; Ratings: AEC-Q200; series: ESD SMD Auto X7R; Size / Dimension: 0.039" L x 0.020" W (1.00mm x 0.50mm); Supplier 1: DigiKey; Supplier Part Number 1: 399-17167-1-ND; Temperature Coefficient: X7R; Thickness (Max): 0.022" (0.55mm); Tolerance: ±10%; Voltage - Rated: 16V
C11 C12 = C0402C103J5RECAUTO: CAP CER 0402 10NF 50V X7R 5%; manufacturer: KEMET; Part Number: C0402C103J5RECAUTO; Value: 10nF; Applications: Automotive, ESD Protection; Capacitance: 10nF; componentlink1description: Datasheet; componentlink1url: https://api.kemet.com/component-edge/download/datasheet/C0402C103J5RECAUTO.pdf; componentlink2description: DigiKey Link; componentlink2url: https://www.digikey.com/en/products/detail/kemet/C0402C103J5RECAUTO/8646448; Device Package: 0402 (1005 Metric); lastupdated: 9.08.2022 12:00:55; Lifecycle Status: Active; Minimum Order: 1; Mounting Type: Surface Mount, MLCC; Operating Temperature: -55°C ~ 125°C; Package / Case: 0402 (1005 Metric); packaging: TapeAndReel; partid: 33153; Part Status: Active; price: 0.02; Ratings: AEC-Q200; series: ESD SMD Auto X7R; Size / Dimension: 0.039" L x 0.020" W (1.00mm x 0.50mm); Supplier 1: DigiKey; Supplier Part Number 1: 399-C0402C103J5RECAUTOCT-ND; Temperature Coefficient: X7R; Thickness (Max): 0.022" (0.55mm); Tolerance: ±5%; Voltage - Rated: 50V
C13 C14 = GRM155C71A105KE11D: CAP CER 1UF 10V X7S 0402; manufacturer: Murata Electronics; Tolerance: ±10%; Part Number: GRM155C71A105KE11D; Value: 1µF; Applications: General Purpose; Capacitance: 1 µF; componentlink1description: Datasheet; componentlink1url: https://search.murata.co.jp/Ceramy/image/img/A01X/G101/ENG/GRM155C71A105KE11-01.pdf; componentlink2description: DigiKey Link; componentlink2url: https://www.digikey.com/en/products/detail/murata-electronics/GRM155C71A105KE11D/6606086; Device Package: 0402 (1005 Metric); lastupdated: 11.08.2022 08:52:24; Lifecycle Status: Active; Minimum Order: 1; Mounting Type: Surface Mount, MLCC; Operating Temperature: -55°C ~ 125°C; Package / Case: 0402 (1005 Metric); packaging: TapeAndReel; partid: 1749; Part Status: Active; price: 0.01; series: GRM; Size / Dimension: 0.039" L x 0.020" W (1.00mm x 0.50mm); Supplier 1: DigiKey; Supplier Part Number 1: 490-14457-1-ND; Temperature Coefficient: X7S; Thickness (Max): 0.024" (0.60mm); Voltage - Rated: 10V
C15 C16 = C0402C270J3GAC7867: CAP CER 27PF 25V NP0 0402; manufacturer: KEMET; Temperature Coefficient: C0G, NP0; Tolerance: ±5%; Part Number: C0402C270J3GAC7867; Value: 27pF; Applications: General Purpose; Capacitance: 27 pF; componentlink1description: Datasheet; componentlink1url: https://api.kemet.com/component-edge/download/datasheet/C0402C270J3GACTU.pdf; componentlink2description: DigiKey Link; componentlink2url: https://www.digikey.com/en/products/detail/kemet/C0402C270J3GAC7867/2196521; Device Package: 0402 (1005 Metric); Features: Low ESL; lastupdated: 11.08.2022 08:52:24; Lifecycle Status: Active; Minimum Order: 1; Mounting Type: Surface Mount, MLCC; Operating Temperature: -55°C ~ 125°C; Package / Case: 0402 (1005 Metric); packaging: TapeAndReel; partid: 1740; Part Status: Active; price: 0.06; series: SMD Comm C0G; Size / Dimension: 0.039" L x 0.020" W (1.00mm x 0.50mm); Supplier 1: DigiKey; Supplier Part Number 1: 399-14437-1-ND; Thickness (Max): 0.022" (0.55mm); Voltage - Rated: 25V
D1-D79 = CMP-2000-04932-2: Fast Switching Diode, 100 V, 0.15 A, -65 to 150 degC, 2-Pin?SOD123, RoHS, Tape and Reel; Recovery Time: 4ns; Brand: DiodesIncorporated; Unit Weight: 0.000353oz; Max Surge Current: 2A; Peak Reverse Voltage: 100V; Ir - Reverse Current: 1uA; Vf - Forward Voltage: 1.25V; Configuration: Single; If - Forward Current: 0.15A; Product Category: Diodes-GeneralPurpose,Power,Switching; Operating Temperature Range: -65Cto+150C; Packaging: Reel; Manufacturer URL: http://www.diodes.com/; Maximum Operating Temperature: +150C; Height: 1.25mm; Minimum Operating Temperature: -65C; Product: SwitchingDiodes; Package URL: http://www.diodes.com/datasheets/ds18004.pdf; Type: SwitchingDiode; Package Reference: SOD123-2; Width: 1.7mm; Datasheet URL: http://www.farnell.com/datasheets/1915529.pdf; Datasheet Version: Rev. 24-2, 10/2013; Series: 1N4148; Factory Pack Quantity: 3000; Length: 2.85mm; RoHS: True; Manufacturer: DiodesIncorporated; Mounting Style: SMD/SMT; Package / Case: SOD-123
ENC1 = CMP-07421-000021-1: ROTARY ENCODER MECHANICAL 24PPR; Built in Switch: Yes; Pulses per Revolution: 24; Output Type: Quadrature; Hole Diameter: 2mm; Number of Channels: 2; Max Supply Voltage (DC): 5V; RoHS Compliant: Yes; Max Operating Temperature: 70°C; Length: 26mm; Width: 12.5mm; Encoder Type: Mechanical; Series: PEC12R; Mount: Through Hole; Height: 13.4mm; Packaging: Bulk; Package Quantity: 150; Termination: PC Pin; Min Operating Temperature: -30°C; REACH SVHC: No SVHC; Detent: Yes; Orientation: Vertical
J1#2 = SM04B-SRSS-TB_LF__SN_: as J1#1 on sheet Daughterboard; Datasheet Link: http://www.jst-mfg.com/product/pdf/eng/eSH.pdf; Arrow Part Number: SM04B-SRSS-TB(LF)(SN); Arrow Price/Stock: https://www.arrow.com/en/products/sm04b-srss-tb-lf-sn/jst-manufacturing
R2#2 R3-R5 R10 = TNPW040210K0BETD: RES 10K OHM 0.1% 1/16W 0402; Manufacturer: Vishay Dale; Power (Watts): 0.063W, 1/16W; Resistance: 10 kOhms; Temperature Coefficient: ±25ppm/°C; Part Number: TNPW040210K0BETD; Value: 10k; ComponentLink1Description: Datasheet; ComponentLink1URL: http://www.vishay.com/docs/31006/tnpw.pdf; ComponentLink2Description: DigiKey Link; ComponentLink2URL: https://www.digikey.com/en/products/detail/vishay-dale/TNPW040210K0BETD/1613222; Composition: Thin Film; Device Package: 0402 (1005 Metric); Features: Military; Height - Seated (Max): 0.016" (0.40mm); LastUpdated: 11.08.2022 09:08:10; Lifecycle Status: Active; Minimum Order: 1; Number of Terminations: 2; Operating Temperature: -55°C ~ 125°C; Package / Case: 0402 (1005 Metric); Packaging: TapeAndReel; PartId: 3021; Part Status: Active; Price: 0.26; Series: TNPW; Size / Dimension: 0.039" L x 0.020" W (1.00mm x 0.50mm); Supplier 1: DigiKey; Supplier Part Number 1: 541-3559-1-ND; Supplier Device Package: 0402; Tolerance: ±0.1%
R6 R9 = AT0402BRD071KL: RES SMD 1K OHM 0.1% 1/16W 0402; Manufacturer: Yageo; Power (Watts): 0.063W, 1/16W; Resistance: 1 kOhms; Temperature Coefficient: ±25ppm/°C; Part Number: AT0402BRD071KL; Value: 1k; ComponentLink1Description: Datasheet; ComponentLink1URL: http://www.yageo.com/documents/recent/PYu-AT_51_RoHS_L_5.pdf; ComponentLink2Description: DigiKey Link; ComponentLink2URL: https://www.digikey.com/en/products/detail/yageo/AT0402BRD071KL/5138607; Composition: Thin Film; Device Package: 0402 (1005 Metric); Features: Anti-Sulfur, Automotive AEC-Q200, Moisture Resistant; Height - Seated (Max): 0.014" (0.35mm); LastUpdated: 11.08.2022 09:08:11; Lifecycle Status: Active; Minimum Order: 1; Number of Terminations: 2; Operating Temperature: -55°C ~ 155°C; Package / Case: 0402 (1005 Metric); Packaging: TapeAndReel; PartId: 2462; Part Status: Active; Price: 0.09; Ratings: AEC-Q200; Series: AT; Size / Dimension: 0.039" L x 0.020" W (1.00mm x 0.50mm); Supplier 1: DigiKey; Supplier Part Number 1: YAG2088CT-ND; Supplier Device Package: 0402; Tolerance: ±0.1%
R7 R8 = RC0402FR-0727RL: RES 27 OHM 1% 1/16W 0402; Manufacturer: Yageo; Power (Watts): 0.063W, 1/16W; Resistance: 27 Ohms; Temperature Coefficient: ±100ppm/°C; Part Number: RC0402FR-0727RL; Value: 27R; ComponentLink1Description: Datasheet; ComponentLink1URL: https://www.yageo.com/upload/media/product/productsearch/datasheet/rchip/PYu-RC_Group_51_RoHS_L_10.pdf; ComponentLink2Description: DigiKey Link; ComponentLink2URL: https://www.digikey.com/en/products/detail/yageo/RC0402FR-0727RL/5280946; Composition: Thick Film; Device Package: 0402 (1005 Metric); Features: Moisture Resistant; Height - Seated (Max): 0.016" (0.40mm); LastUpdated: 11.08.2022 09:08:11; Lifecycle Status: Active; Minimum Order: 1; Number of Terminations: 2; Operating Temperature: -55°C ~ 155°C; Package / Case: 0402 (1005 Metric); Packaging: CutTape; PartId: 2558; Part Status: Active; Price: 0.01; Series: RC_L; Size / Dimension: 0.039" L x 0.020" W (1.00mm x 0.50mm); Supplier 1: DigiKey; Supplier Part Number 1: YAG3086CT-ND; Supplier Device Package: 0402; Tolerance: ±1%
SW1-SW78 = CPG151101S11 - Kailh Hotswap Socket
U1#2 = W25Q128JVSIQ_TR: Inductor; Manufacturer_Name: Winbond; Manufacturer_Part_Number: W25Q128JVSIQ TR; Datasheet Link: http://www.winbond.com/resource-files/w25q128jv%20spi%20revc%2011162016.pdf; Height: 1.95mm; Mouser Part Number: 454-W25Q128JVSIQTR; Mouser Price/Stock: https://www.mouser.co.uk/ProductDetail/Winbond/W25Q128JVSIQ-TR?qs=qSfuJ%252Bfl%2Fd7vTyLA9kNdGw%3D%3D; Arrow Part Number: W25Q128JVSIQ TR; Arrow Price/Stock: https://www.arrow.com/en/products/w25q128jvsiqtr/winbond-electronics?region=nac
U2#2 = RP2040: Raspberry Pi RP2040 Mcu, 32 Bit, 133MHZ, QFN-56;
Y1 = ABM8G-12.000MHZ-18-D2Y-T: CRYSTAL 12.0000MHZ 18PF SMD; Manufacturer: Abracon LLC; ESR (Equivalent Series Resistance): 120 Ohms; Frequency Stability: ±30ppm; Frequency Tolerance: ±20ppm; Operating Mode: Fundamental; Part Number: ABM8G-12.000MHZ-18-D2Y-T; ComponentLink1Description: Datasheet; ComponentLink1URL: https://abracon.com/Resonators/ABM8G.pdf; ComponentLink2Description: DigiKey Link; ComponentLink2URL: http://digikey.com/product-detail/en/abracon-llc/ABM8G-12.000MHZ-18-D2Y-T/535-10261-1-ND/2218074; Device Package: 4-SMD, No Lead; Frequency: 12MHz; Height - Seated (Max): 0.039" (1.00mm); LastUpdated: 19.03.2020 22:36:25; Lifecycle Status: Active; Load Capacitance: 18pF; Minimum Order: 1; Mounting Type: Surface Mount; Operating Temperature: -40°C ~ 85°C; Package / Case: 4-SMD, No Lead; Packaging: TapeAndReel; PartId: 310; Part Status: Active; Price: 0.59; Series: ABM8G; Size / Dimension: 0.126" L x 0.098" W (3.20mm x 2.50mm); Supplier 1: DigiKey; Supplier Part Number 1: 535-10261-1-ND; Type: MHz Crystal; Value: 12MHz

## Nets that join several sheets
+3V3: Daughterboard (C2#1.2 J1#1.1 U2#1.2 U2#1.4), Mainboard (23 pins)
GND: Daughterboard (13 pins), Mainboard (26 pins)